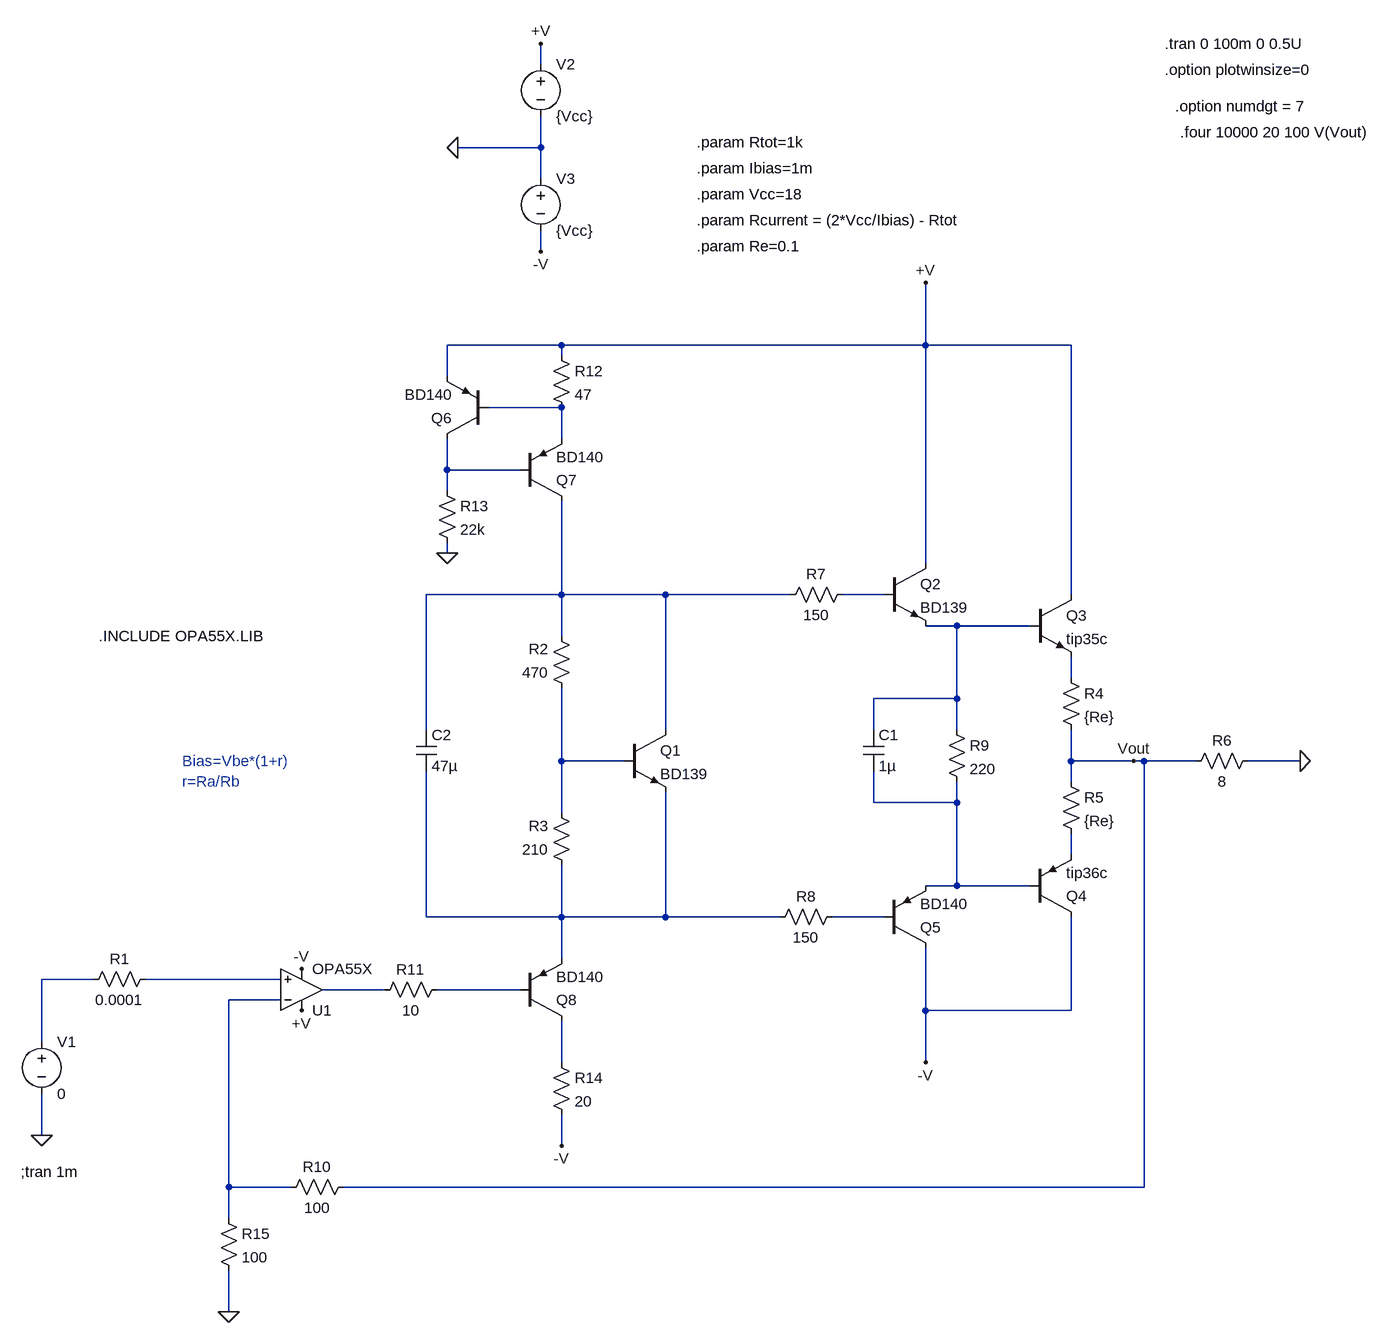
[diagram p0: schematic V1 - DC.asc]
V1 - DC.asc, the LTspice schematic file:
Version 4
SHEET 1 1192 964
WIRE -112 -976 -112 -1008
WIRE -112 -848 -112 -896
WIRE -112 -848 -240 -848
WIRE -112 -800 -112 -848
WIRE -112 -688 -112 -720
WIRE -80 -544 -256 -544
WIRE 480 -544 480 -640
WIRE 480 -544 -80 -544
WIRE 704 -544 480 -544
WIRE -80 -528 -80 -544
WIRE -256 -496 -256 -544
WIRE -80 -448 -192 -448
WIRE -80 -400 -80 -448
WIRE -256 -352 -256 -400
WIRE -144 -352 -256 -352
WIRE -256 -320 -256 -352
WIRE -256 -224 -256 -240
WIRE 480 -208 480 -544
WIRE -80 -160 -80 -304
WIRE -80 -160 -288 -160
WIRE 80 -160 -80 -160
WIRE 272 -160 80 -160
WIRE 416 -160 352 -160
WIRE 704 -160 704 -544
WIRE 528 -112 480 -112
WIRE 640 -112 528 -112
WIRE -80 -96 -80 -160
WIRE 704 -32 704 -64
WIRE 528 0 528 -112
WIRE 528 0 400 0
WIRE -288 48 -288 -160
WIRE 80 48 80 -160
WIRE 400 48 400 0
WIRE 528 48 528 0
WIRE -80 96 -80 -16
WIRE 16 96 -80 96
WIRE 704 96 704 48
WIRE 800 96 704 96
WIRE 816 96 800 96
WIRE 896 96 816 96
WIRE 1056 96 976 96
WIRE 704 128 704 96
WIRE 400 160 400 112
WIRE 528 160 528 128
WIRE 528 160 400 160
WIRE -80 176 -80 96
WIRE 704 240 704 208
WIRE 528 288 528 160
WIRE 528 288 480 288
WIRE 640 288 528 288
WIRE -288 336 -288 112
WIRE -80 336 -80 256
WIRE -80 336 -288 336
WIRE 80 336 80 144
WIRE 80 336 -80 336
WIRE 256 336 80 336
WIRE 416 336 336 336
WIRE -80 400 -80 336
WIRE -800 432 -880 432
WIRE -512 432 -720 432
WIRE -352 448 -448 448
WIRE -144 448 -272 448
WIRE -512 464 -592 464
WIRE 480 480 480 384
WIRE 704 480 704 336
WIRE 704 480 480 480
WIRE -880 528 -880 432
WIRE -80 560 -80 496
WIRE 480 560 480 480
WIRE -880 672 -880 608
WIRE -80 688 -80 640
WIRE -592 752 -592 464
WIRE -496 752 -592 752
WIRE 816 752 816 96
WIRE 816 752 -416 752
WIRE -592 800 -592 752
WIRE -592 944 -592 880
FLAG 480 -640 +V
FLAG 480 560 -V
FLAG -880 672 0
FLAG -240 -848 0
FLAG -112 -1008 +V
FLAG -112 -688 -V
FLAG 1056 96 0
FLAG 800 96 Vout
FLAG -80 688 -V
FLAG -480 480 +V
FLAG -480 416 -V
FLAG -256 -224 0
FLAG -592 944 0
SYMBOL voltage -880 512 R0
WINDOW 123 0 0 Left 0
WINDOW 39 0 0 Left 0
SYMATTR InstName V1
SYMATTR Value 0
SYMBOL res -704 416 R90
WINDOW 0 0 56 VBottom 2
WINDOW 3 32 56 VTop 2
SYMATTR InstName R1
SYMATTR Value 0.0001
SYMBOL res -64 0 R180
WINDOW 0 36 76 Left 2
WINDOW 3 36 40 Left 2
SYMATTR InstName R2
SYMATTR Value 470
SYMBOL res -64 272 R180
WINDOW 0 36 76 Left 2
WINDOW 3 36 40 Left 2
SYMATTR InstName R3
SYMATTR Value 210
SYMBOL npn 16 48 R0
SYMATTR InstName Q1
SYMATTR Value BD139
SYMBOL npn 416 -208 R0
SYMATTR InstName Q2
SYMATTR Value BD139
SYMBOL npn 640 -160 R0
SYMATTR InstName Q3
SYMATTR Value tip35c
SYMBOL pnp 640 336 M180
SYMATTR InstName Q4
SYMATTR Value tip36c
SYMBOL pnp 416 384 M180
SYMATTR InstName Q5
SYMATTR Value BD140
SYMBOL res 688 -48 R0
SYMATTR InstName R4
SYMATTR Value {Re}
SYMBOL res 688 112 R0
SYMATTR InstName R5
SYMATTR Value {Re}
SYMBOL voltage -112 -992 R0
WINDOW 123 0 0 Left 0
WINDOW 39 0 0 Left 0
SYMATTR InstName V2
SYMATTR Value {Vcc}
SYMBOL voltage -112 -816 R0
WINDOW 123 0 0 Left 0
WINDOW 39 0 0 Left 0
SYMATTR InstName V3
SYMATTR Value {Vcc}
SYMBOL res 992 80 R90
WINDOW 0 0 56 VBottom 2
WINDOW 3 32 56 VTop 2
SYMATTR InstName R6
SYMATTR Value 8
SYMBOL res 368 -176 R90
WINDOW 0 0 56 VBottom 2
WINDOW 3 32 56 VTop 2
SYMATTR InstName R7
SYMATTR Value 150
SYMBOL res 352 320 R90
WINDOW 0 0 56 VBottom 2
WINDOW 3 32 56 VTop 2
SYMATTR InstName R8
SYMATTR Value 150
SYMBOL res 512 32 R0
SYMATTR InstName R9
SYMATTR Value 220
SYMBOL cap 384 48 R0
SYMATTR InstName C1
SYMATTR Value 1µ
SYMBOL cap -304 48 R0
SYMATTR InstName C2
SYMATTR Value 47µ
SYMBOL OpAmps\\opamp2 -480 512 M180
SYMATTR InstName U1
SYMATTR Value OPA55X
SYMBOL res -400 736 R90
WINDOW 0 0 56 VBottom 2
WINDOW 3 32 56 VTop 2
SYMATTR InstName R10
SYMATTR Value 100
SYMBOL res -256 432 R90
WINDOW 0 0 56 VBottom 2
WINDOW 3 32 56 VTop 2
SYMATTR InstName R11
SYMATTR Value 10
SYMBOL pnp -192 -400 R180
SYMATTR InstName Q6
SYMATTR Value BD140
SYMBOL res -96 -544 R0
SYMATTR InstName R12
SYMATTR Value 47
SYMBOL pnp -144 -304 M180
SYMATTR InstName Q7
SYMATTR Value BD140
SYMBOL res -272 -336 R0
SYMATTR InstName R13
SYMATTR Value 22k
SYMBOL res -96 544 R0
SYMATTR InstName R14
SYMATTR Value 20
SYMBOL pnp -144 496 M180
SYMATTR InstName Q8
SYMATTR Value BD140
SYMBOL res -608 784 R0
SYMATTR InstName R15
SYMATTR Value 100
TEXT -664 96 Left 2 ;Bias=Vbe*(1+r)\nr=Ra/Rb
TEXT 128 -856 Left 2 !.param Rtot=1k
TEXT 128 -816 Left 2 !.param Ibias=1m
TEXT 128 -776 Left 2 !.param Vcc=18
TEXT 128 -736 Left 2 !.param Rcurrent = (2*Vcc/Ibias) - Rtot
TEXT 128 -696 Left 2 !.param Re=0.1
TEXT -912 728 Left 2 !;tran 1m
TEXT 848 -1008 Left 2 !.tran 0 100m 0 0.5U
TEXT 848 -968 Left 2 !.option plotwinsize=0
TEXT 864 -912 Left 2 !.option numdgt = 7
TEXT 872 -872 Left 2 !.four 10000 20 100 V(Vout)
TEXT -792 -96 Left 2 !.INCLUDE OPA55X.LIB

The netlist it stands for:
* V1 - DC.asc
V1 N012 0 0
R1 N013 N012 0.0001
R2 N007 N003 470
R3 N010 N007 210
Q1 N003 N007 N010 0 BD139
Q2 +V N004 N005 0 BD139
Q3 +V N005 N006 0 tip35c
Q4 -V N008 N009 0 tip36c
Q5 -V N011 N008 0 BD140
R4 N006 Vout {Re}
R5 Vout N009 {Re}
V2 +V 0 {Vcc}
V3 0 -V {Vcc}
R6 0 Vout 8
R7 N004 N003 150
R8 N011 N010 150
R9 N005 N008 220
C1 N005 N008 1µ
C2 N003 N010 47µ
XU1 N013 N016 +V -V N014 OPA55X  ; pins In+ In- V+ V- OUT
R10 Vout N016 100
R11 N015 N014 10
Q6 N002 N001 +V 0 BD140
R12 +V N001 47
Q7 N003 N002 N001 0 BD140
R13 N002 0 22k
R14 N017 -V 20
Q8 N017 N015 N010 0 BD140
R15 N016 0 100
.model NPN NPN
.model PNP PNP
.lib standard.bjt
* Bias=Vbe*(1+r)
* r=Ra/Rb
.param Rtot=1k
.param Ibias=1m
.param Vcc=18
.param Rcurrent = (2*Vcc/Ibias) - Rtot
.param Re=0.1
;tran 1m
.tran 0 100m 0 0.5U
.option plotwinsize=0
.option numdgt = 7
.four 10000 20 100 V(Vout)
.INCLUDE OPA55X.LIB
.backanno
.end